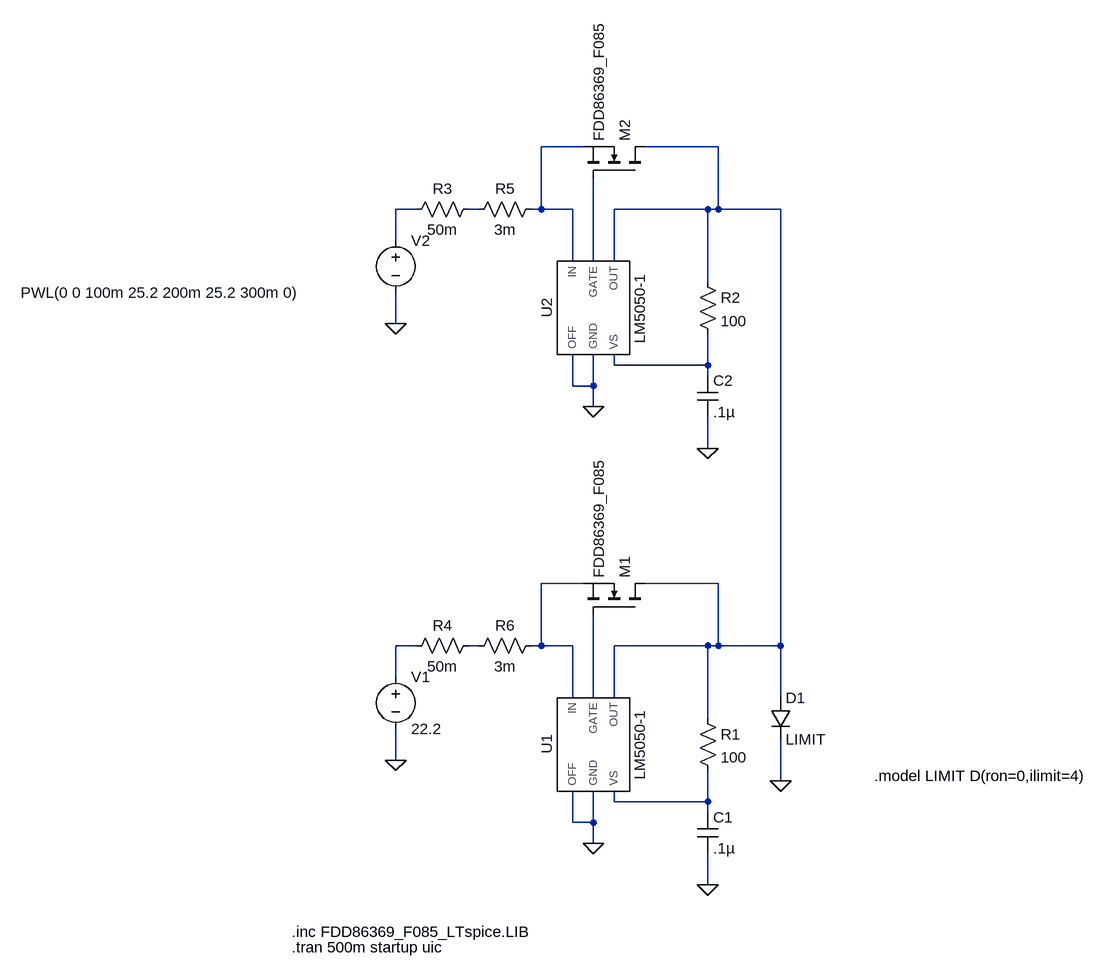
[diagram p0: schematic VBAT Reverse Polarity.asc]
VBAT Reverse Polarity.asc, the LTspice schematic file:
Version 4
SHEET 1 1800 680
WIRE 224 -640 160 -640
WIRE 432 -640 320 -640
WIRE -32 -544 -64 -544
WIRE 64 -544 48 -544
WIRE 160 -544 160 -640
WIRE 160 -544 144 -544
WIRE 208 -544 160 -544
WIRE 416 -544 272 -544
WIRE 432 -544 432 -640
WIRE 432 -544 416 -544
WIRE 528 -544 432 -544
WIRE -64 -496 -64 -544
WIRE 208 -464 208 -544
WIRE 240 -464 240 -592
WIRE 272 -464 272 -544
WIRE 416 -432 416 -544
WIRE -64 -368 -64 -416
WIRE 272 -304 272 -320
WIRE 416 -304 416 -352
WIRE 416 -304 272 -304
WIRE 416 -288 416 -304
WIRE 208 -272 208 -320
WIRE 240 -272 240 -320
WIRE 240 -272 208 -272
WIRE 240 -240 240 -272
WIRE 416 -176 416 -224
WIRE 224 32 160 32
WIRE 432 32 320 32
WIRE -32 128 -64 128
WIRE 64 128 48 128
WIRE 160 128 160 32
WIRE 160 128 144 128
WIRE 208 128 160 128
WIRE 416 128 272 128
WIRE 432 128 432 32
WIRE 432 128 416 128
WIRE 528 128 528 -544
WIRE 528 128 432 128
WIRE -64 176 -64 128
WIRE 208 208 208 128
WIRE 240 208 240 80
WIRE 272 208 272 128
WIRE 528 208 528 128
WIRE 416 240 416 128
WIRE -64 304 -64 256
WIRE 528 336 528 272
WIRE 272 368 272 352
WIRE 416 368 416 320
WIRE 416 368 272 368
WIRE 416 384 416 368
WIRE 208 400 208 352
WIRE 240 400 240 352
WIRE 240 400 208 400
WIRE 240 432 240 400
WIRE 416 496 416 448
FLAG -64 304 0
FLAG 528 336 0
FLAG 240 432 0
FLAG 416 496 0
FLAG 240 -240 0
FLAG 416 -176 0
FLAG -64 -368 0
SYMBOL voltage -64 160 R0
WINDOW 123 0 0 Left 0
WINDOW 39 0 0 Left 0
SYMATTR InstName V1
SYMATTR Value 22.2
SYMBOL diode 512 208 R0
SYMATTR InstName D1
SYMATTR Value LIMIT
SYMBOL LM5050-1 240 288 R270
SYMATTR InstName U1
SYMBOL nmos 320 80 M270
SYMATTR InstName M1
SYMATTR Value FDD86369_F085
SYMATTR Prefix X
SYMBOL cap 400 384 R0
SYMATTR InstName C1
SYMATTR Value .1µ
SYMBOL res 400 224 R0
SYMATTR InstName R1
SYMATTR Value 100
SYMBOL LM5050-1 240 -384 R270
SYMATTR InstName U2
SYMBOL nmos 320 -592 M270
SYMATTR InstName M2
SYMATTR Value FDD86369_F085
SYMATTR Prefix X
SYMBOL cap 400 -288 R0
SYMATTR InstName C2
SYMATTR Value .1µ
SYMBOL res 400 -448 R0
SYMATTR InstName R2
SYMATTR Value 100
SYMBOL res 64 112 R90
WINDOW 0 0 56 VBottom 2
WINDOW 3 32 56 VTop 2
SYMATTR InstName R4
SYMATTR Value 50m
SYMBOL res 160 -560 R90
WINDOW 0 0 56 VBottom 2
WINDOW 3 32 56 VTop 2
SYMATTR InstName R5
SYMATTR Value 3m
SYMBOL res 160 112 R90
WINDOW 0 0 56 VBottom 2
WINDOW 3 32 56 VTop 2
SYMATTR InstName R6
SYMATTR Value 3m
SYMBOL voltage -64 -512 R0
WINDOW 3 -577 96 Left 2
WINDOW 123 0 0 Left 0
WINDOW 39 0 0 Left 0
SYMATTR Value PWL(0 0 100m 25.2 200m 25.2 300m 0)
SYMATTR InstName V2
SYMBOL res 64 -560 R90
WINDOW 0 0 56 VBottom 2
WINDOW 3 32 56 VTop 2
SYMATTR InstName R3
SYMATTR Value 50m
TEXT -224 568 Left 2 !.inc FDD86369_F085_LTspice.LIB
TEXT 672 328 Left 2 !.model LIMIT D(ron=0,ilimit=4)
TEXT -224 592 Left 2 !.tran 500m startup uic

The netlist it stands for:
* VBAT Reverse Polarity.asc
V1 N008 0 22.2
D1 N002 0 LIMIT
XU1 N011 0 0 N007 N010 N002 LM5050-1  ; pins VS GND OFF IN GATE OUT
XM1 N002 N010 N007 FDD86369_F085  ; pins D G S
C1 N011 0 .1µ
R1 N002 N011 100
XU2 N006 0 0 N001 N005 N002 LM5050-1  ; pins VS GND OFF IN GATE OUT
XM2 N002 N005 N001 FDD86369_F085  ; pins D G S
C2 N006 0 .1µ
R2 N002 N006 100
R4 N009 N008 50m
R5 N001 N004 3m
R6 N007 N009 3m
V2 N003 0 PWL(0 0 100m 25.2 200m 25.2 300m 0)
R3 N004 N003 50m
.model D D
.lib standard.dio
.inc FDD86369_F085_LTspice.LIB
.model LIMIT D(ron=0,ilimit=4)
.tran 500m startup uic
.lib LM5050-1.LIB
.backanno
.end